# Altium schematic sheet V_№8.SchDoc
size 420 x 297 mm; Organization: ИЯФ СО РАН; DesignedBy: Ланшаков П. О.; ProductName: Схема электрическая принципиальная информационного канала (Варинат 8); NumberOfSheets: 1; DecimalNumber: АБВГ.ХХХХХХ.ХХХ Э3
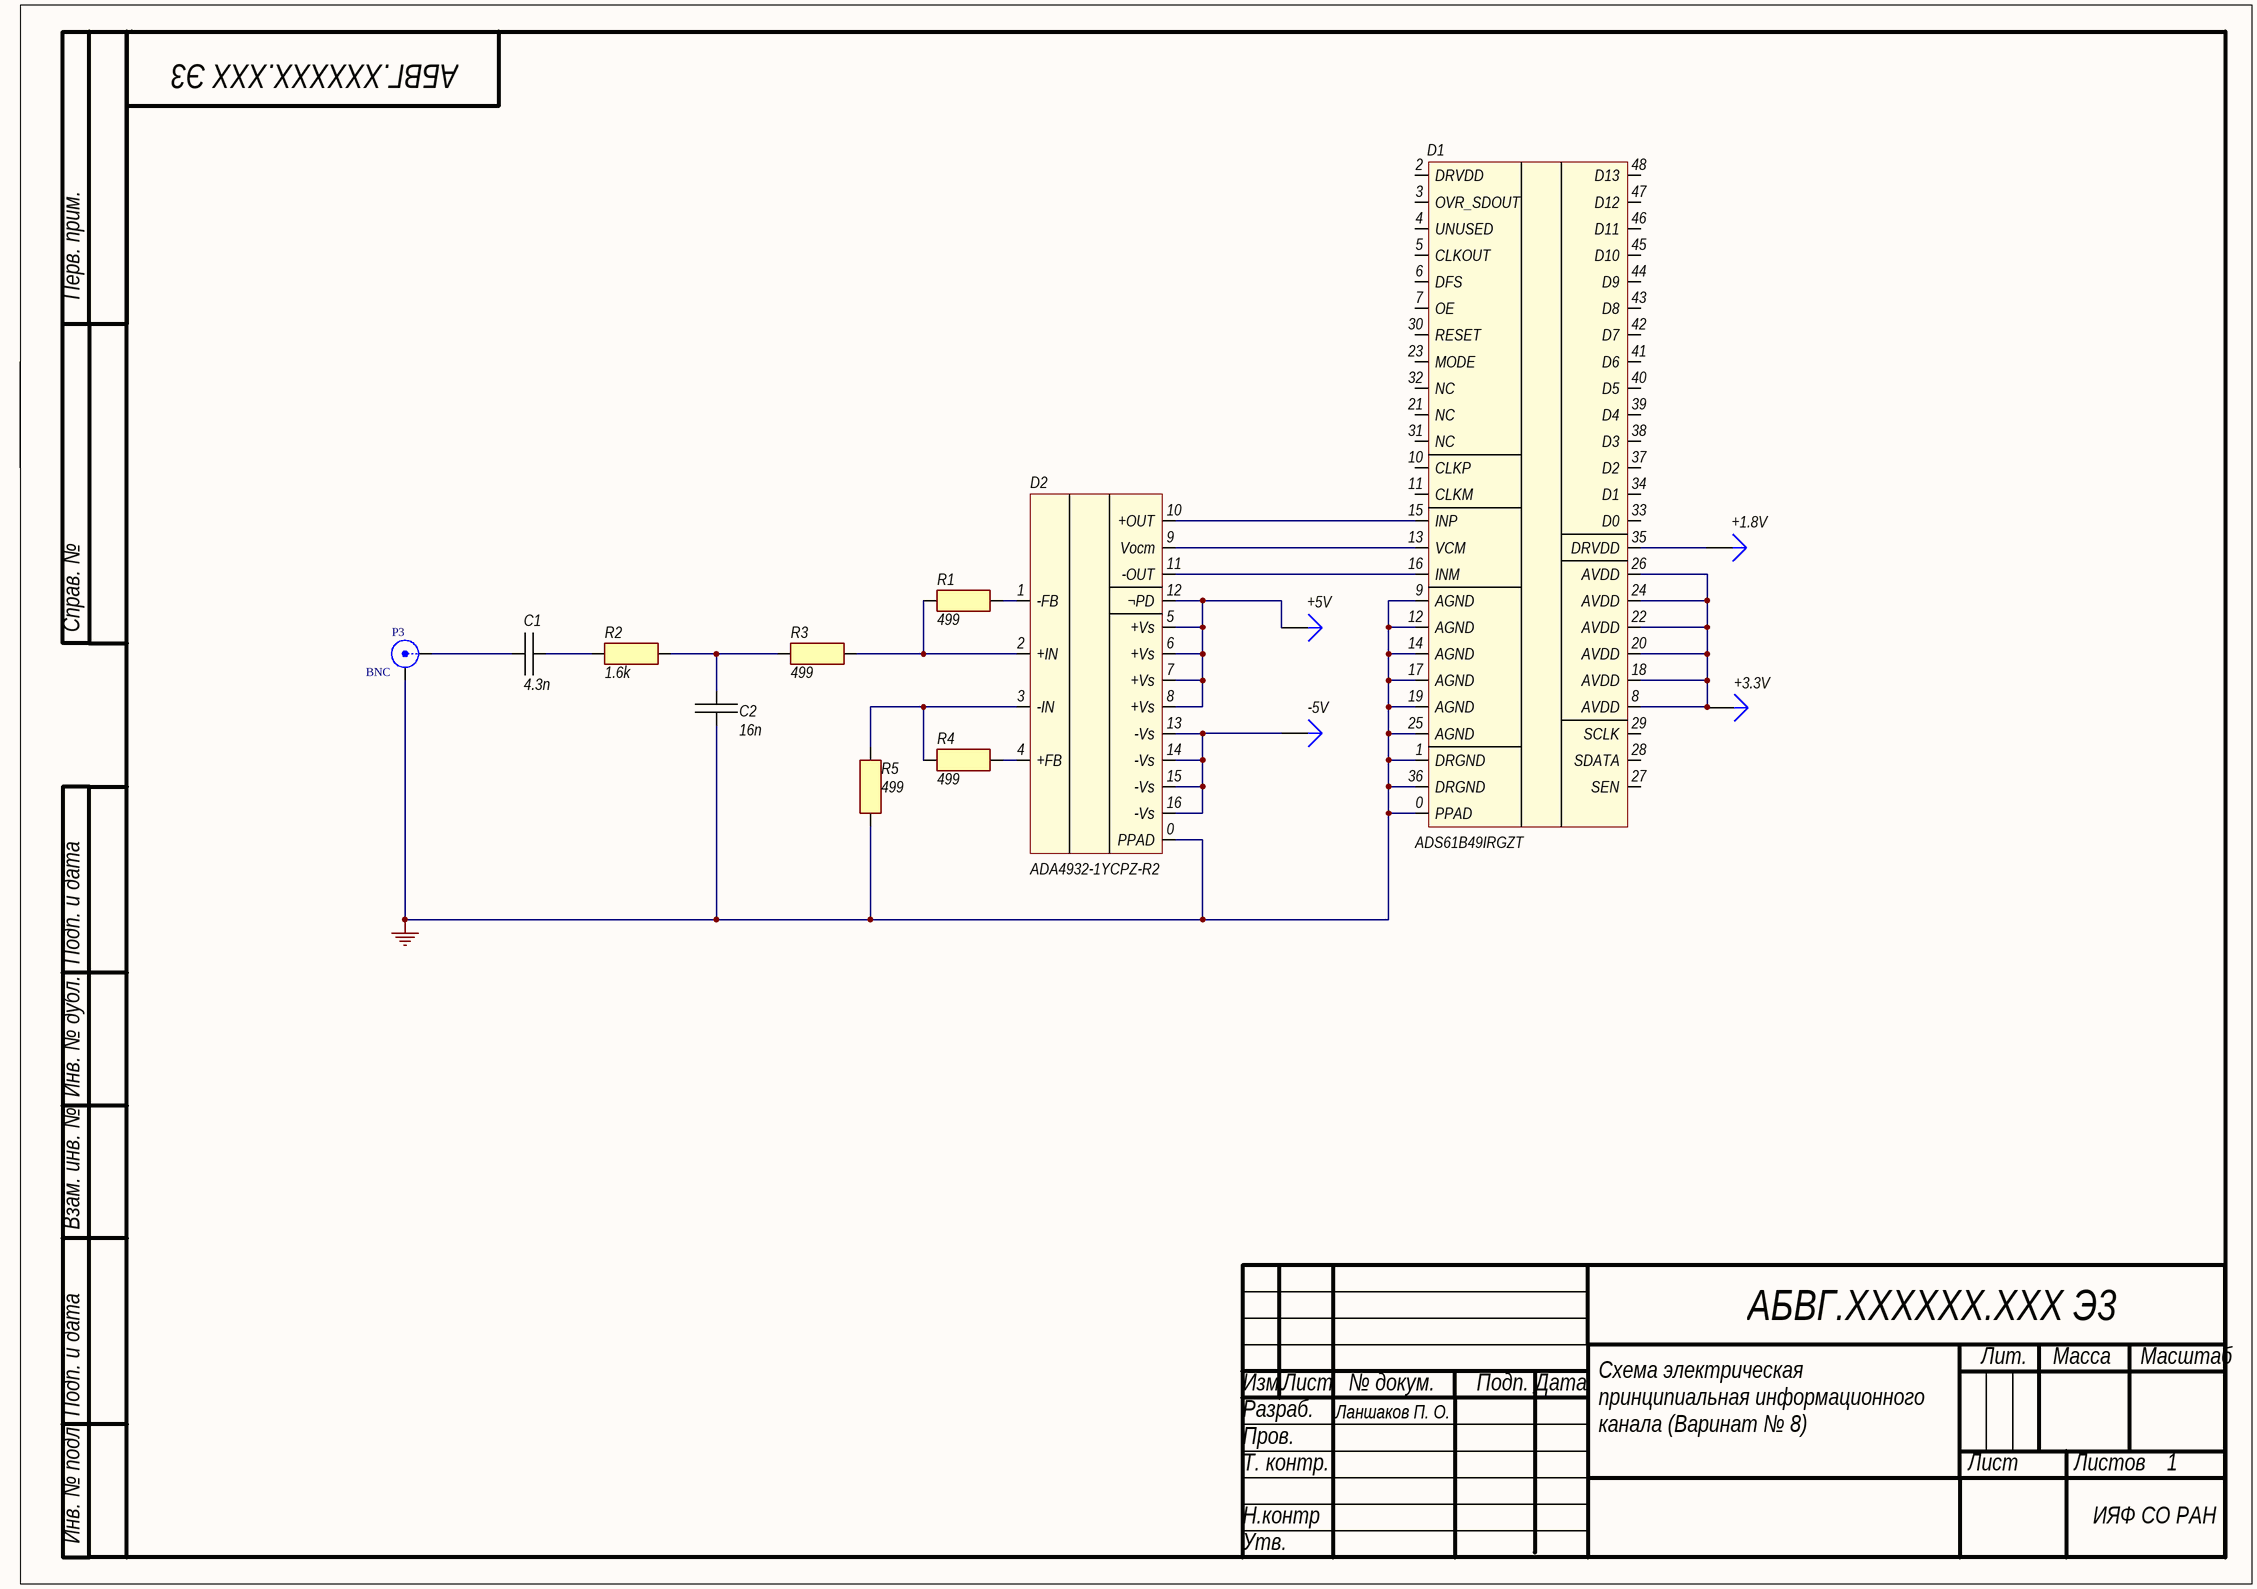
[diagram p0: V_№8.SchDoc]

## Parts
+1.8V  Plug  [PIN1]  (value not drawn)
+3.3V  Plug  [PIN1]  (value not drawn)
+5V  Plug  [PIN1]  (value not drawn)
-5V  Plug  [PIN1]  (value not drawn)
C1  4.3п  [0101]
C2  16п  [0101]
D1  ADS61B49IRGZT  [QFN50P700X700X100_HS-49N]
D2  ADA4932-1YCPZ-R2  [QFN50P300X300X100_HS-17N]
P3  BNC  [BNC_RA CON]
R1  499  [0201]
R2  1.6k  [0201]
R3  499  [0201]
R4  499  [0201]
R5  499  [0201]

## Nets
GND: C2.1(-FB) D1.0(PPAD) D1.1(DRGND) D1.9(AGND) D1.12(AGND) D1.14(AGND) D1.17(AGND) D1.19(AGND) D1.25(AGND) D1.36(DRGND) D2.0(PPAD) P3.2(Y) R5.2
Net+1.8V_1: +1.8V.1 D1.35(DRVDD)
Net+3.3V_1: +3.3V.1 D1.8(AVDD) D1.18(AVDD) D1.20(AVDD) D1.22(AVDD) D1.24(AVDD) D1.26(AVDD)
Net+5V_1: +5V.1 D2.5(+Vs) D2.6(+Vs) D2.7(+Vs) D2.8(+Vs) D2.12(¬PD)
Net-5V_1: -5V.1 D2.13(-Vs) D2.14(-Vs) D2.15(-Vs) D2.16(-Vs)
NetC1_1: C1.1(-FB) P3.1(X)
NetC1_2: C1.2(+IN) R2.2
NetC2_2: C2.2(+IN) R2.1 R3.2
NetD1_13: D1.13(VCM) D2.9(Vocm)
NetD1_15: D1.15(INP) D2.10(+OUT)
NetD1_16: D1.16(INM) D2.11(-OUT)
NetD2_1: D2.1(-FB) R1.1
NetD2_2: D2.2(+IN) R1.2 R3.1
NetD2_3: D2.3(-IN) R4.2 R5.1
NetD2_4: D2.4(+FB) R4.1

Not connected (* = marked no-connect by the designer): D1 2(DRVDD) 3(OVR_SDOUT) 4(UNUSED) 5(CLKOUT) 6(DFS) 7(OE) 10(CLKP) 11(CLKM) 21(NC) 23(MODE) 27(SEN) 28(SDATA) 29(SCLK) 30(RESET) 31(NC) 32(NC) 33(D0) 34(D1) 37(D2) 38(D3) 39(D4) 40(D5) 41(D6) 42(D7) 43(D8) 44(D9) 45(D10) 46(D11) 47(D12) 48(D13)

## Notes on the sheet
- Перв. прим.
- Справ. №
- Подп. и дата
- Инв. № дубл.
- Взам. инв. №
- Изм.
- Лист
- № докум.
- Подп.
- Дата
- Лит.
- Масса
- Масштаб
- Разраб.
- Пров.
- Т. контр.
- Схема электрическая принципиальная информационного канала (Варинат № 8)
- Листов
- Инв. № подл.
- Н.контр
- Утв.

## Library data of the parts
C1 C2 = Capacitor: HelpURL: *; PartNumber: *; Manufacturer: *; Package: *
  C1: Value: *
  C2: Value: 16п
D1 = ADS61B49: Manufacturer: Texas Instruments; HelpURL: https://www.digikey.com/product-detail/en/texas-instruments/ADS61B49IRGZT/296-24045-2-ND/1990125; PartNumber: ADS61B49IRGZT; Package: 48-VQFN (7x7)
D2 = ADA4932: Manufacturer: Analog Devices Inc.; HelpURL: https://www.digikey.com/product-detail/en/analog-devices-inc/ADA4932-1YCPZ-R2/ADA4932-1YCPZ-R2TR-ND/1981972; PartNumber: ADA4932-1YCPZ-R2; Package: 6-VFQFN Exposed Pad, CSP
P3 = BNC: BNC Elbow Connector; LatestRevisionDate: 17-Jul-2002; LatestRevisionNote: Re-released for DXP Platform.; Publisher: Altium Limited
R1-R5 = Resistor: HelpURL: *; Model: *; Manufacturer: *; Package: *
  R1 R3-R5: Value: 499
  R2: Value: 1.6k
+1.8V +3.3V +5V -5V = Plug: LatestRevisionDate: 17-Jul-2002; LatestRevisionNote: Re-released for DXP Platform.; Publisher: Altium Limited